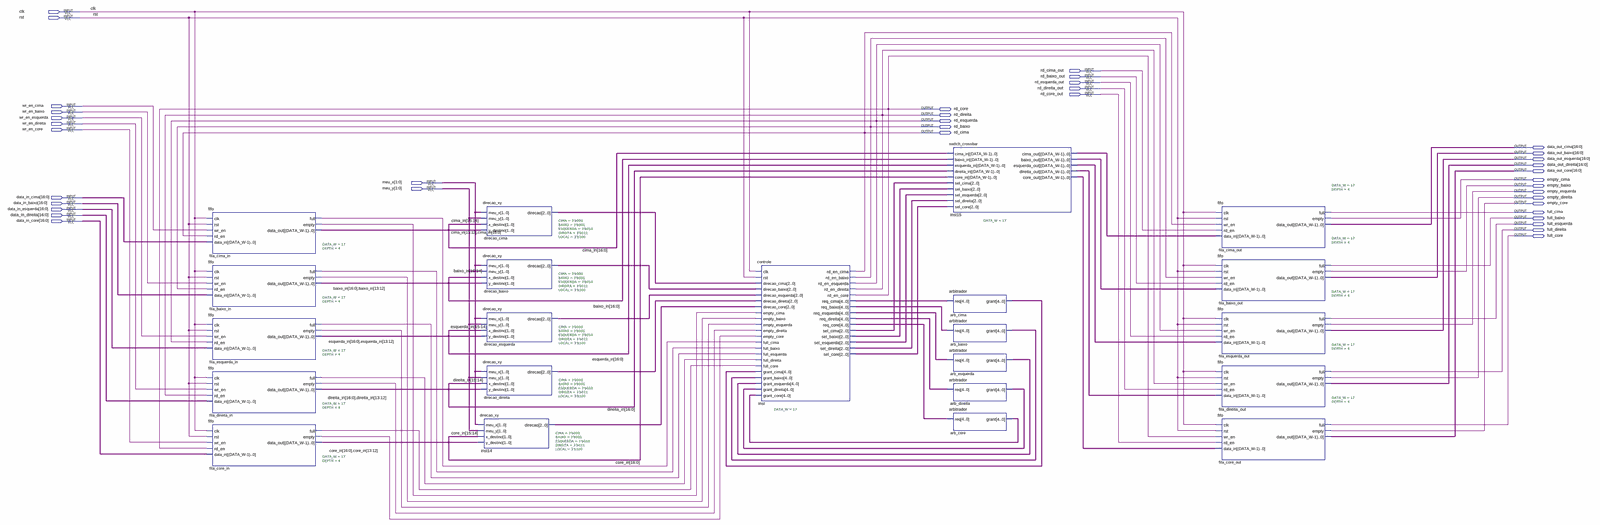
[diagram p0: schematic sheet, whole]
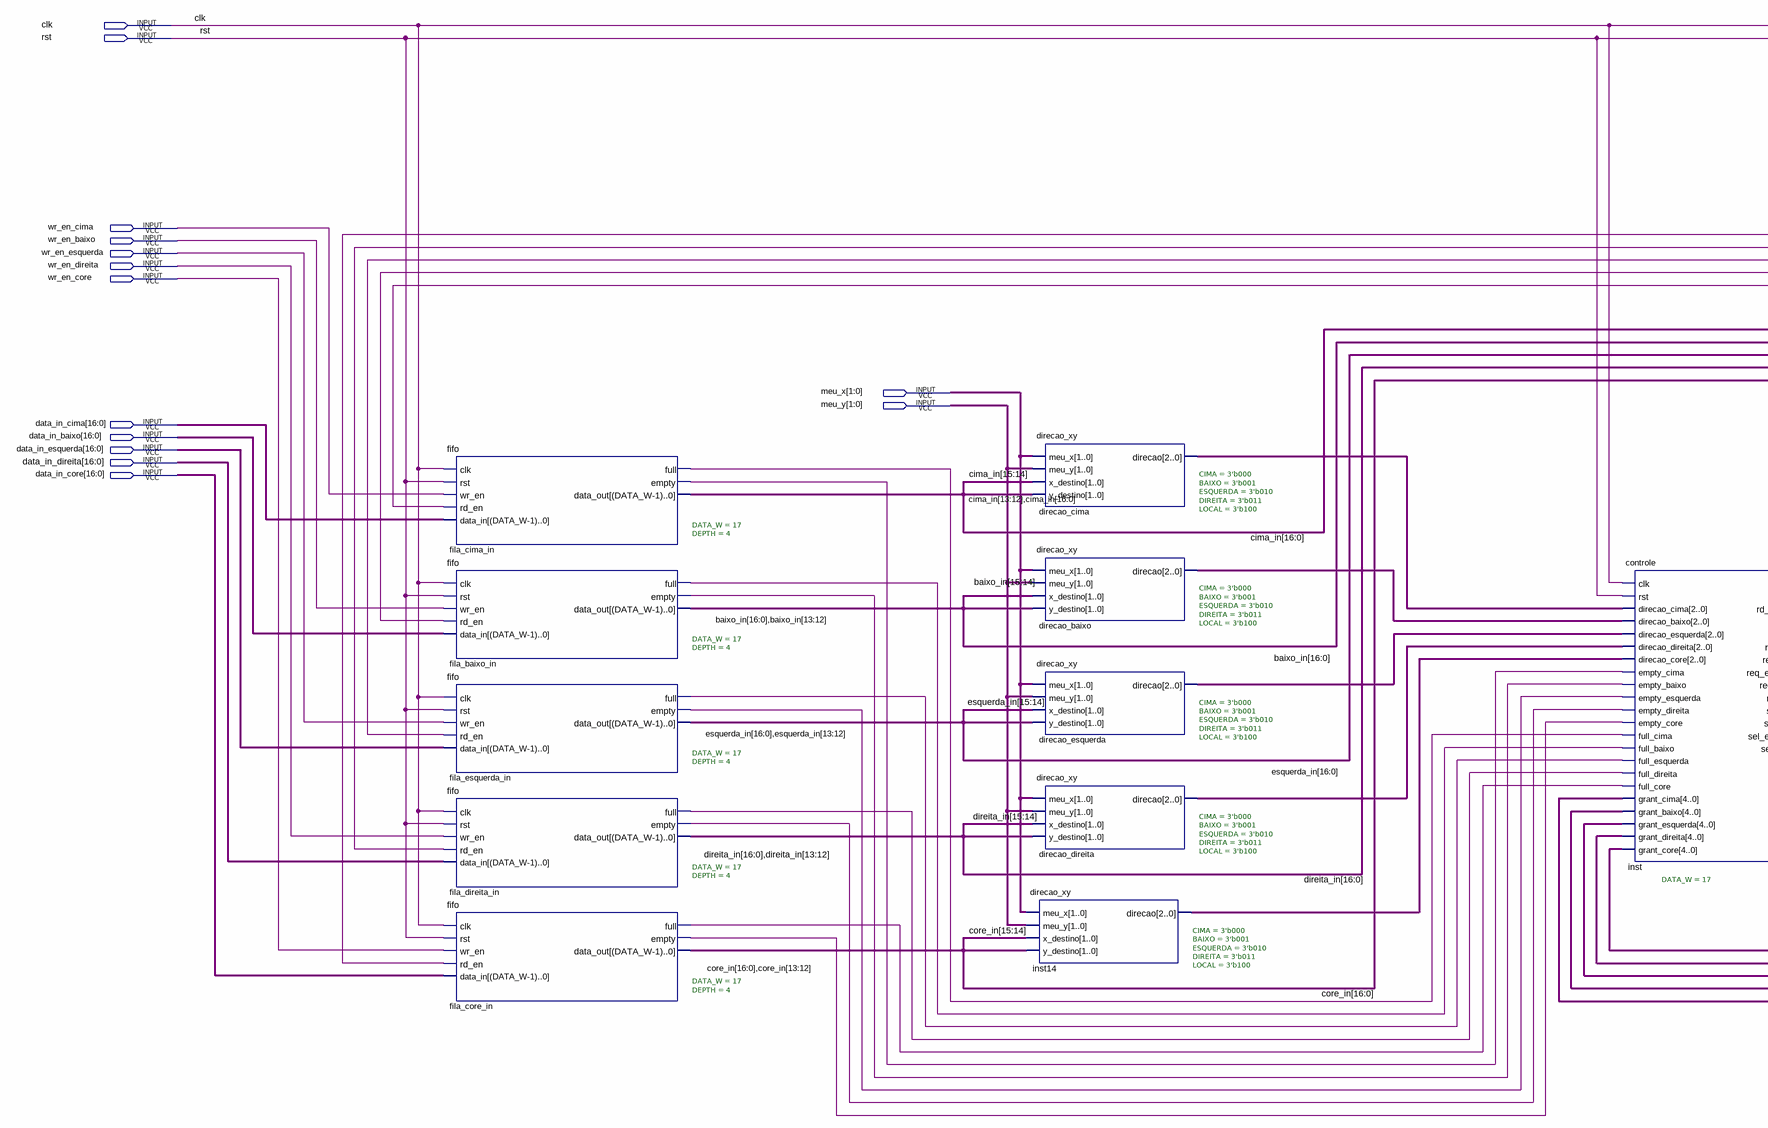
[diagram p1: schematic sheet, left part]
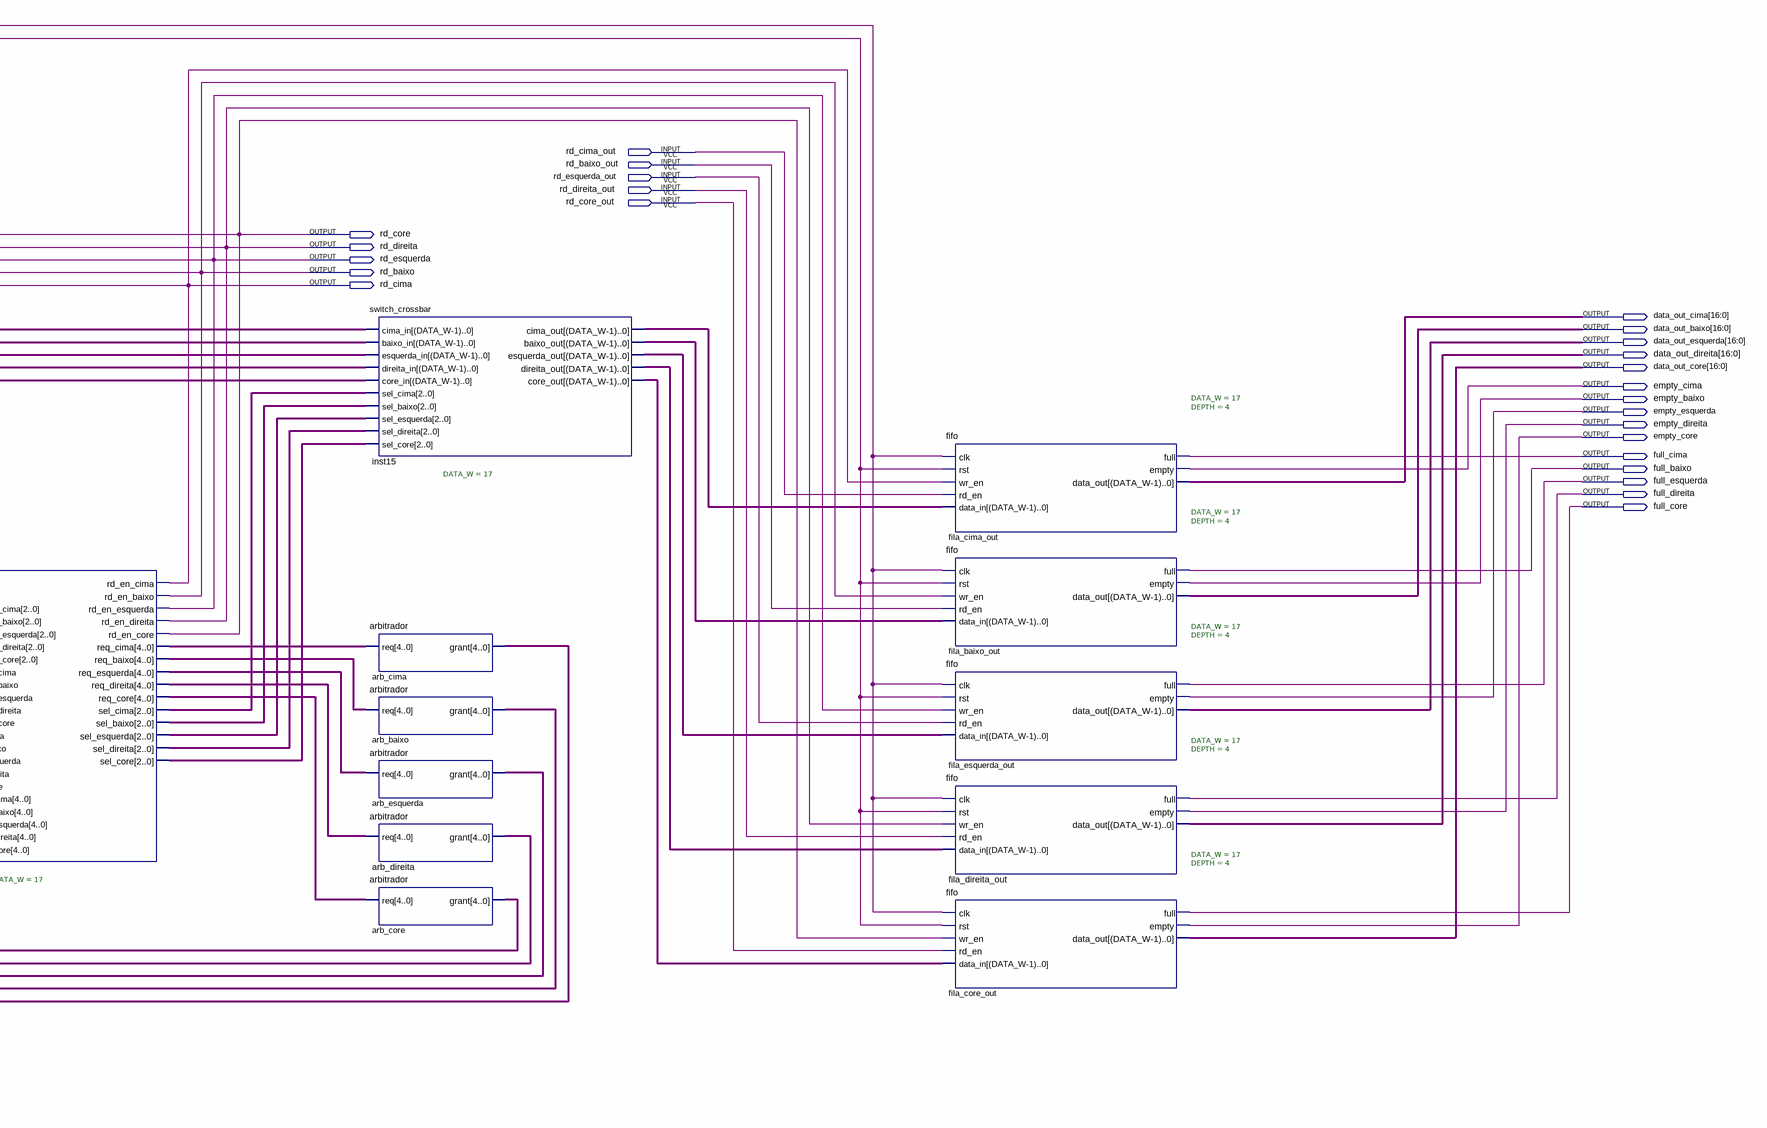
[diagram p2: schematic sheet, right part]
// Quartus schematic lixo.bdf as structural Verilog: 22 symbols, 39 pins
module lixo (
  input  clk,
  input  rst,
  input  rd_cima_out,
  input  rd_baixo_out,
  input  rd_esquerda_out,
  input  rd_direita_out,
  input  rd_core_out,
  input  wr_en_cima,
  input  wr_en_baixo,
  input  wr_en_esquerda,
  input  wr_en_direita,
  input  wr_en_core,
  input  [1:0] meu_x,
  input  [1:0] meu_y,
  input  [16:0] data_in_cima,
  input  [16:0] data_in_baixo,
  input  [16:0] data_in_esquerda,
  input  [16:0] data_in_direita,
  input  [16:0] data_in_core,
  output rd_core,
  output rd_direita,
  output rd_esquerda,
  output rd_baixo,
  output rd_cima,
  output [16:0] data_out_cima,
  output [16:0] data_out_baixo,
  output [16:0] data_out_esquerda,
  output [16:0] data_out_direita,
  output [16:0] data_out_core,
  output empty_cima,
  output empty_baixo,
  output empty_esquerda,
  output empty_direita,
  output empty_core,
  output full_cima,
  output full_baixo,
  output full_esquerda,
  output full_direita,
  output full_core
);

  wire fila_baixo_in_empty, fila_baixo_in_full, fila_cima_in_empty, fila_cima_in_full, fila_core_in_empty,
       fila_core_in_full, fila_direita_in_empty, fila_direita_in_full, fila_esquerda_in_empty,
       fila_esquerda_in_full;
  wire [2:0] direcao_baixo_direcao, direcao_cima_direcao, direcao_direita_direcao, direcao_esquerda_direcao,
       inst14_direcao, inst_sel_baixo, inst_sel_cima, inst_sel_core, inst_sel_direita, inst_sel_esquerda;
  wire [4:0] arb_baixo_grant, arb_cima_grant, arb_core_grant, arb_direita_grant, arb_esquerda_grant,
       inst_req_baixo, inst_req_cima, inst_req_core, inst_req_direita, inst_req_esquerda;
  wire [16:0] baixo_in, cima_in, core_in, direita_in, esquerda_in, inst15_baixo_out, inst15_cima_out,
       inst15_core_out, inst15_direita_out, inst15_esquerda_out;

  fifo #(.DATA_W(17), .DEPTH(4)) fila_cima_in (
    .clk(clk), .rst(rst), .wr_en(wr_en_cima), .rd_en(rd_cima), .data_in(data_in_cima),
    .full(fila_cima_in_full), .empty(fila_cima_in_empty), .data_out({cima_in[13:12], cima_in}));
  fifo #(.DATA_W(17), .DEPTH(4)) fila_baixo_in (
    .clk(clk), .rst(rst), .wr_en(wr_en_baixo), .rd_en(rd_baixo), .data_in(data_in_baixo),
    .full(fila_baixo_in_full), .empty(fila_baixo_in_empty), .data_out({baixo_in, baixo_in[13:12]}));
  fifo #(.DATA_W(17), .DEPTH(4)) fila_esquerda_in (
    .clk(clk), .rst(rst), .wr_en(wr_en_esquerda), .rd_en(rd_esquerda), .data_in(data_in_esquerda),
    .full(fila_esquerda_in_full), .empty(fila_esquerda_in_empty), .data_out({esquerda_in, esquerda_in[13:12]}));
  fifo #(.DATA_W(17), .DEPTH(4)) fila_direita_in (
    .clk(clk), .rst(rst), .wr_en(wr_en_direita), .rd_en(rd_direita), .data_in(data_in_direita),
    .full(fila_direita_in_full), .empty(fila_direita_in_empty), .data_out({direita_in, direita_in[13:12]}));
  fifo #(.DATA_W(17), .DEPTH(4)) fila_core_in (
    .clk(clk), .rst(rst), .wr_en(wr_en_core), .rd_en(rd_core), .data_in(data_in_core),
    .full(fila_core_in_full), .empty(fila_core_in_empty), .data_out({core_in, core_in[13:12]}));
  direcao_xy #(.CIMA(3'b000), .BAIXO(3'b001), .ESQUERDA(3'b010), .DIREITA(3'b011), .LOCAL(3'b100)) direcao_cima (
    .meu_x(meu_x), .meu_y(meu_y), .x_destino(cima_in[15:14]), .y_destino({cima_in[13:12], cima_in}),
    .direcao(direcao_cima_direcao));
  direcao_xy #(.CIMA(3'b000), .BAIXO(3'b001), .ESQUERDA(3'b010), .DIREITA(3'b011), .LOCAL(3'b100)) direcao_baixo (
    .meu_x(meu_x), .meu_y(meu_y), .x_destino(baixo_in[15:14]), .y_destino({baixo_in, baixo_in[13:12]}),
    .direcao(direcao_baixo_direcao));
  direcao_xy #(.CIMA(3'b000), .BAIXO(3'b001), .ESQUERDA(3'b010), .DIREITA(3'b011), .LOCAL(3'b100)) direcao_esquerda (
    .meu_x(meu_x), .meu_y(meu_y), .x_destino(esquerda_in[15:14]),
    .y_destino({esquerda_in, esquerda_in[13:12]}), .direcao(direcao_esquerda_direcao));
  direcao_xy #(.CIMA(3'b000), .BAIXO(3'b001), .ESQUERDA(3'b010), .DIREITA(3'b011), .LOCAL(3'b100)) direcao_direita (
    .meu_x(meu_x), .meu_y(meu_y), .x_destino(direita_in[15:14]), .y_destino({direita_in, direita_in[13:12]}),
    .direcao(direcao_direita_direcao));
  direcao_xy #(.CIMA(3'b000), .BAIXO(3'b001), .ESQUERDA(3'b010), .DIREITA(3'b011), .LOCAL(3'b100)) inst14 (
    .meu_x(meu_x), .meu_y(meu_y), .x_destino(core_in[15:14]), .y_destino({core_in, core_in[13:12]}),
    .direcao(inst14_direcao));
  controle #(.DATA_W(17)) inst (
    .clk(clk), .rst(rst), .direcao_cima(direcao_cima_direcao), .direcao_baixo(direcao_baixo_direcao),
    .direcao_esquerda(direcao_esquerda_direcao), .direcao_direita(direcao_direita_direcao),
    .direcao_core(inst14_direcao), .empty_cima(fila_cima_in_empty), .empty_baixo(fila_baixo_in_empty),
    .empty_esquerda(fila_esquerda_in_empty), .empty_direita(fila_direita_in_empty),
    .empty_core(fila_core_in_empty), .full_cima(fila_cima_in_full), .full_baixo(fila_baixo_in_full),
    .full_esquerda(fila_esquerda_in_full), .full_direita(fila_direita_in_full),
    .full_core(fila_core_in_full), .grant_cima(arb_cima_grant), .grant_baixo(arb_baixo_grant),
    .grant_esquerda(arb_esquerda_grant), .grant_direita(arb_direita_grant), .grant_core(arb_core_grant),
    .rd_en_cima(rd_cima), .rd_en_baixo(rd_baixo), .rd_en_esquerda(rd_esquerda), .rd_en_direita(rd_direita),
    .rd_en_core(rd_core), .req_cima(inst_req_cima), .req_baixo(inst_req_baixo),
    .req_esquerda(inst_req_esquerda), .req_direita(inst_req_direita), .req_core(inst_req_core),
    .sel_cima(inst_sel_cima), .sel_baixo(inst_sel_baixo), .sel_esquerda(inst_sel_esquerda),
    .sel_direita(inst_sel_direita), .sel_core(inst_sel_core));
  switch_crossbar #(.DATA_W(17)) inst15 (
    .cima_in(cima_in), .baixo_in(baixo_in), .esquerda_in(esquerda_in), .direita_in(direita_in),
    .core_in(core_in), .sel_cima(inst_sel_cima), .sel_baixo(inst_sel_baixo),
    .sel_esquerda(inst_sel_esquerda), .sel_direita(inst_sel_direita), .sel_core(inst_sel_core),
    .cima_out(inst15_cima_out), .baixo_out(inst15_baixo_out), .esquerda_out(inst15_esquerda_out),
    .direita_out(inst15_direita_out), .core_out(inst15_core_out));
  arbitrador arb_cima (.req(inst_req_cima), .grant(arb_cima_grant));
  arbitrador arb_baixo (.req(inst_req_baixo), .grant(arb_baixo_grant));
  arbitrador arb_esquerda (.req(inst_req_esquerda), .grant(arb_esquerda_grant));
  arbitrador arb_direita (.req(inst_req_direita), .grant(arb_direita_grant));
  arbitrador arb_core (.req(inst_req_core), .grant(arb_core_grant));
  fifo #(.DATA_W(17), .DEPTH(4)) fila_cima_out (
    .clk(clk), .rst(rst), .wr_en(rd_cima), .rd_en(rd_cima_out), .data_in(inst15_cima_out), .full(full_cima),
    .empty(empty_cima), .data_out(data_out_cima));
  fifo #(.DATA_W(17), .DEPTH(4)) fila_baixo_out (
    .clk(clk), .rst(rst), .wr_en(rd_baixo), .rd_en(rd_baixo_out), .data_in(inst15_baixo_out),
    .full(full_baixo), .empty(empty_baixo), .data_out(data_out_baixo));
  fifo #(.DATA_W(17), .DEPTH(4)) fila_esquerda_out (
    .clk(clk), .rst(rst), .wr_en(rd_esquerda), .rd_en(rd_esquerda_out), .data_in(inst15_esquerda_out),
    .full(full_esquerda), .empty(empty_esquerda), .data_out(data_out_esquerda));
  fifo #(.DATA_W(17), .DEPTH(4)) fila_direita_out (
    .clk(clk), .rst(rst), .wr_en(rd_direita), .rd_en(rd_direita_out), .data_in(inst15_direita_out),
    .full(full_direita), .empty(empty_direita), .data_out(data_out_direita));
  fifo #(.DATA_W(17), .DEPTH(4)) fila_core_out (
    .clk(clk), .rst(rst), .wr_en(rd_core), .rd_en(rd_core_out), .data_in(inst15_core_out), .full(full_core),
    .empty(empty_core), .data_out(data_out_core));
endmodule
